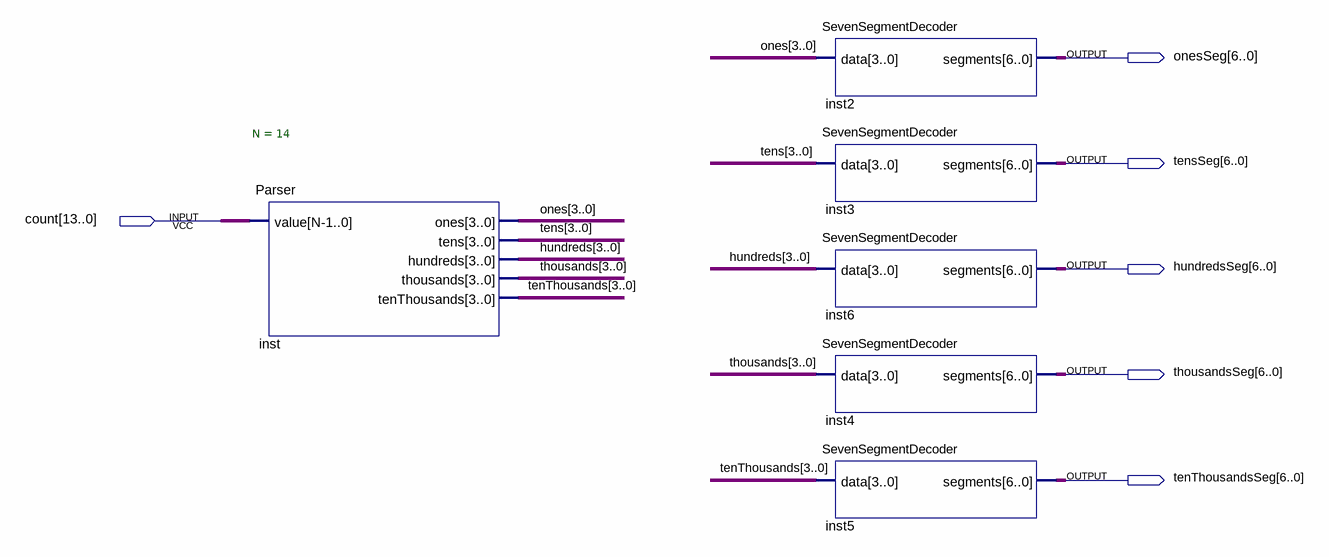
[diagram p0: schematic sheet]
// Quartus schematic SevenSegmentOutput.bdf as structural Verilog: 6 symbols, 6 pins
module SevenSegmentOutput (
  input  [13:0] count,
  output [6:0] onesSeg,
  output [6:0] tensSeg,
  output [6:0] hundredsSeg,
  output [6:0] thousandsSeg,
  output [6:0] tenThousandsSeg
);

  wire [3:0] hundreds, ones, tens, tenThousands, thousands;

  Parser #(.N(14)) inst (
    .value(count), .ones(ones), .tens(tens), .hundreds(hundreds), .thousands(thousands),
    .tenThousands(tenThousands));
  SevenSegmentDecoder inst2 (.data(ones), .segments(onesSeg));
  SevenSegmentDecoder inst3 (.data(tens), .segments(tensSeg));
  SevenSegmentDecoder inst6 (.data(hundreds), .segments(hundredsSeg));
  SevenSegmentDecoder inst4 (.data(thousands), .segments(thousandsSeg));
  SevenSegmentDecoder inst5 (.data(tenThousands), .segments(tenThousandsSeg));
endmodule
